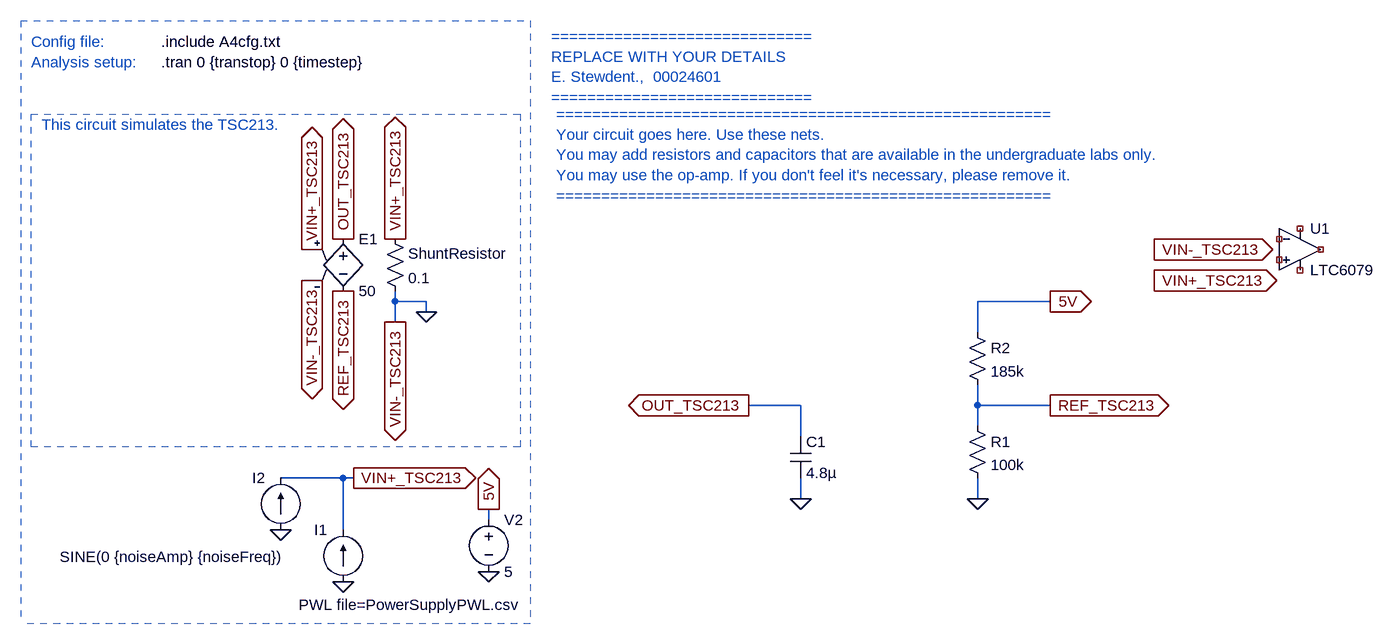
[diagram p0: schematic E344_19872887_A4.asc]
E344_19872887_A4.asc, the LTspice schematic file:
Version 4
SHEET 1 1824 680
WIRE -1792 -992 -1792 -1008
WIRE -1744 -992 -1792 -992
WIRE -784 -992 -896 -992
WIRE -1744 -976 -1744 -992
WIRE -1792 -960 -1792 -992
WIRE -896 -944 -896 -992
WIRE -1168 -832 -1248 -832
WIRE -896 -832 -896 -864
WIRE -784 -832 -896 -832
WIRE -896 -800 -896 -832
WIRE -1168 -784 -1168 -832
WIRE -1872 -720 -1968 -720
WIRE -1856 -720 -1872 -720
WIRE -1168 -688 -1168 -720
WIRE -896 -688 -896 -720
WIRE -1648 -656 -1648 -672
WIRE -1872 -640 -1872 -720
FLAG -1648 -672 5V
IOPIN -1648 -672 Out
FLAG -1648 -576 0
FLAG -1248 -832 OUT_TSC213
IOPIN -1248 -832 Out
FLAG -624 -1072 VIN-_TSC213
IOPIN -624 -1072 Out
FLAG -624 -1024 VIN+_TSC213
IOPIN -624 -1024 Out
FLAG -1872 -560 0
FLAG -1792 -1088 VIN+_TSC213
IOPIN -1792 -1088 Out
FLAG -1792 -960 VIN-_TSC213
IOPIN -1792 -960 Out
FLAG -1920 -1024 VIN-_TSC213
IOPIN -1920 -1024 Out
FLAG -1920 -1072 VIN+_TSC213
IOPIN -1920 -1072 Out
FLAG -1872 -1008 REF_TSC213
IOPIN -1872 -1008 Out
FLAG -1872 -1088 OUT_TSC213
IOPIN -1872 -1088 Out
FLAG -1856 -720 VIN+_TSC213
IOPIN -1856 -720 Out
FLAG -1968 -640 0
FLAG -784 -992 5V
IOPIN -784 -992 Out
FLAG -1168 -688 0
FLAG -1744 -976 0
FLAG -784 -832 REF_TSC213
IOPIN -784 -832 Out
FLAG -896 -688 0
SYMBOL e -1872 -1104 R0
SYMATTR InstName E1
SYMATTR Value 50
SYMBOL current -1872 -560 R180
WINDOW 0 24 80 Left 2
WINDOW 3 -271 -35 Left 2
WINDOW 123 0 0 Left 0
WINDOW 39 0 0 Left 0
SYMATTR InstName I1
SYMATTR Value PWL file=PowerSupplyPWL.csv
SYMBOL res -1808 -1104 R0
WINDOW 0 36 38 Left 2
SYMATTR InstName ShuntResistor
SYMATTR Value 0.1
SYMBOL voltage -1648 -672 R0
WINDOW 123 0 0 Left 0
WINDOW 39 0 0 Left 0
SYMATTR InstName V2
SYMATTR Value 5
SYMBOL current -1968 -640 R180
WINDOW 0 24 80 Left 2
WINDOW 3 -7 -41 Left 2
WINDOW 123 0 0 Left 0
WINDOW 39 0 0 Left 0
SYMATTR InstName I2
SYMATTR Value SINE(0 {noiseAmp} {noiseFreq})
SYMBOL OpAmps\\LTC6079 -400 -1072 R0
SYMATTR InstName U1
SYMBOL cap -1184 -784 R0
SYMATTR InstName C1
SYMATTR Value 4.8µ
SYMBOL res -912 -816 R0
SYMATTR InstName R1
SYMATTR Value 100k
SYMBOL res -912 -960 R0
SYMATTR InstName R2
SYMATTR Value 185k
TEXT -2152 -1360 Left 2 !.tran 0 {transtop} 0 {timestep}
TEXT -2152 -1392 Left 2 !.include A4cfg.txt
TEXT -2352 -1392 Left 2 ;Config file:
TEXT -2352 -1360 Left 2 ;Analysis setup:
TEXT -1552 -1400 Left 2 ;=============================\nREPLACE WITH YOUR DETAILS\nE. Stewdent.,  00024601\n=============================
TEXT -1544 -1280 Left 2 ;=======================================================\nYour circuit goes here. Use these nets.\nYou may add resistors and capacitors that are available in the undergraduate labs only.\nYou may use the op-amp. If you don't feel it's necessary, please remove it.\n=======================================================
TEXT -2336 -1264 Left 2 ;This circuit simulates the TSC213.
LINE Normal -1584 -1424 -1584 -496 2
LINE Normal -2368 -1424 -1584 -1424 2
LINE Normal -1584 -496 -2368 -496 2
LINE Normal -1584 -512 -1584 -512 2
LINE Normal -2368 -1424 -2368 -496 2
RECTANGLE Normal -2352 -1280 -1600 -768 2

The netlist it stands for:
* E344_19872887_A4.asc
E1 OUT_TSC213 REF_TSC213 VIN+_TSC213 0 50
I1 0 VIN+_TSC213 PWL file=PowerSupplyPWL.csv
R§ShuntResistor VIN+_TSC213 0 0.1
V2 5V 0 5
I2 0 VIN+_TSC213 SINE(0 {noiseAmp} {noiseFreq})
XU1 NC_01 NC_02 NC_03 NC_04 NC_05 LTC6078  ; LTC6079, pins In+ In- V+ V- OUT
C1 OUT_TSC213 0 4.8µ
R1 REF_TSC213 0 100k
R2 5V REF_TSC213 185k
.tran 0 {transtop} 0 {timestep}
.include A4cfg.txt
* Config file:
* Analysis setup:
* =============================
* REPLACE WITH YOUR DETAILS
* E. Stewdent.,  00024601
* =============================
* =======================================================
* Your circuit goes here. Use these nets.
* You may add resistors and capacitors that are available in the undergraduate labs only.
* You may use the op-amp. If you don't feel it's necessary, please remove it.
* =======================================================
* This circuit simulates the TSC213.
.lib LTC5.lib
.backanno
.end

* Results of the author's LTspice run, read from the files saved beside the schematic
* Operating Point, zero values left out:
*   V(out_tsc213) = 1.754 V
*   V(ref_tsc213) = 1.754 V
*   V(5v) = 5 V
*   I(R2) = 17.54 µA
*   I(R1) = 17.54 µA
*   I(V2) = -17.54 µA
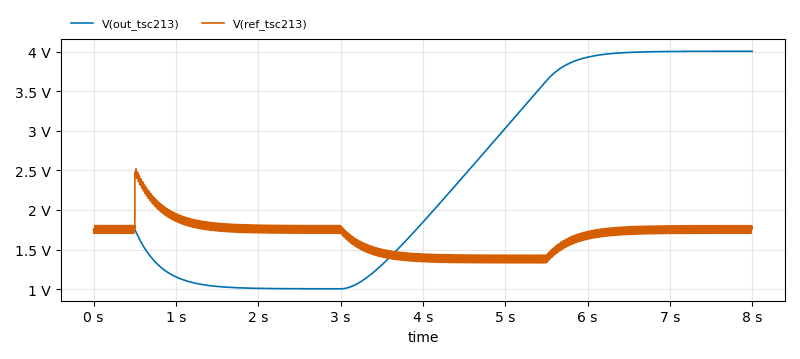
[diagram p1: Transient Analysis of E344_19872887_A4.asc, plotted from the saved traces]
* Transient Analysis, 1 run:
*   V(out_tsc213): min 1.004 V, max 4.005 V, average 2.37 V, rms 2.676 V, last 4.004 V
*   V(ref_tsc213): min 1.331 V, max 2.521 V, average 1.667 V, rms 1.68 V, last 1.754 V